# Altium schematic sheet 04-Power_3v3.SchDoc: Power
size A; Revision: A; SheetNumber: 4; SheetTotal: 6
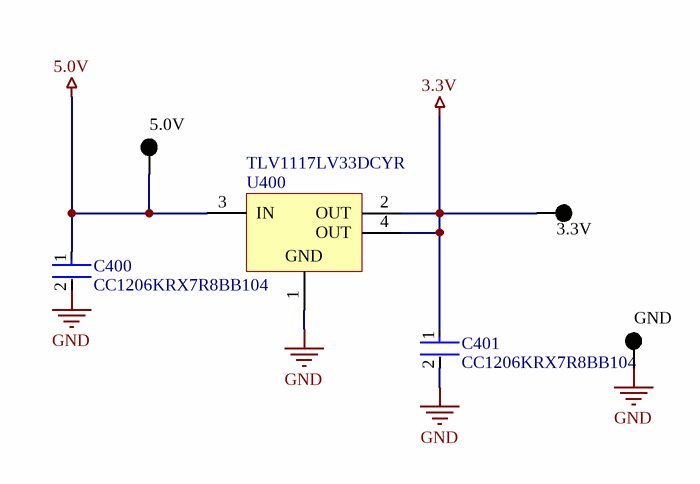
[diagram p0: 04-Power_3v3.SchDoc]

## Parts
3.3V  5011  [KSTN-5011_V]  (value not drawn)
5.0V  5011  [KSTN-5011_V]  (value not drawn)
C400  CC1206KRX7R8BB104  [FP-CC1206-1_25-MFG]
C401  CC1206KRX7R8BB104  [FP-CC1206-1_25-MFG]
GND  5011  [KSTN-5011_V]  (value not drawn)
U400  TLV1117LV33DCYR  [DCY0004A_N]

## Nets
3.3V: 3.3V.1 C401.1 U400.2(OUT) U400.4(OUT)
5.0V: 5.0V.1 C400.1 U400.3(IN)
GND: C400.2 C401.2 GND.1 U400.1(GND)

## Notes on the sheet
- Title:
- Size:
- A
- Project
- Rev:
- Sheet:
- of
- College of Engineering
- 1415 Engineering Drive
- Madison, WI 53706

## Library data of the parts
3.3V 5.0V GND = CMP-1672-00003-4: Test Point, Black, Through Hole, RoHS, Bulk; Manufacturer: Keystone; ComponentLink2URL: http://www.keyelco.com/product-pdf.cfm?p=1320; Colour: Black; Pins: 1; REACH SVHC: No SVHC; ComponentLink1URL: http://www.keyelco.com/; PackageReference: 5011; Contact Plating: Silver; Package Quantity: 100; Packaging: Bulk; RoHSCompliant: true; Height: 8.12 mm; PackageDescription: 1-Pin Through Hole Device, Dia 3.17 mm; Mount: Through Hole; Mounting Technology: Through Hole; DatasheetVersion: Rev. F, 12/2013; ComponentLink1Description: Manufacturer URL; Contact Material: Bronze; ComponentLink2Description: Datasheet
C400 C401 = CMP-1037-04191-3: CAP CER 0.1UF 25V X7R 1206; Manufacturer: Yageo; Value: 100 nF; Material: Ceramic; Tolerance: 0.1; Automotive Grade: NA; Temperature Coefficient: 15%; Description: CC1206 100 nF X7R 10.00%25 V; Category: Cap; Voltage Rating: 25 V; Temperature Range Low: -55°C; Lead Free: Yes; Mouser Description: Multilayer Ceramic Capacitors MLCC - SMD/SMT 100nF 25V X7R 10%; Manufacturer Part Number: CC1206KRX7R8BB104; Octopart: https://octopart.com/cc1206krx7r8bb104-yageo-42334534; Device Class L1: Passive Components; Capacitance: 100 nF; RoHS: TRUE; Automotive: No; Package: CC1206-1.25; Device Class L2: Capacitors; Footprint Url: http://www.yageo.com/exep/pages/download/literatures/UPY-C_GEN_24.pdf; Height: 1.45mm; Temperature: -55°C to +125°C; Temperature Range High: +125°C; ComponentLink2URL: http://www.yageo.com/documents/recent/UPY-NP0X7R_HV_1KV-to-3KV_11.pdf; Temperature Characteristic: X7R; Device Class L3: Ceramic Capacitors; Digikey Description: CAP CER 0.1UF 25V X7R 1206; ComponentLink2Description: Datasheet
U400 = CMP-0395-00503-2: Single Output LDO, 1 A, Fixed 3.3 V Output, 2 to 5.5 V Input, 4-pin SOT-223 (DCY), -40 to 125 degC, Green (RoHS & no Sb/Br); Manufacturer: Texas Instruments; Vout Adj(Min)(V): 3.3; Vdo(Typ)(mV): 1200; Iq(Typ)(mA): 0.05; Accuracy(%): 2; Iout(Max)(A): 1; SubFamily: Single Channel LDO; Vin(Max)(V): 5.5; PackageReference: DCY0004A; PackageDescription: 4-Pin Plastic Small Outline, Body 3.5 x 6.5 mm, Pitch 2.3 mm; Vout Adj(Max)(V): 3.3; Mounting Technology: Surface Mount; ComponentLink2Description: Datasheet; ComponentLink1Description: Manufacturer URL; PartNumber: TLV1117LV33DCYR; ComponentLink3Description: Package Specification; ComponentLink1URL: http://www.ti.com/; ComponentLink2URL: http://www.ti.com/general/docs/lit/getliterature.tsp?genericPartNumber=TLV1117LV33&fileType=pdf; Fixed Output Options(V): 3.3; PackageVersion: 4202506/B; Vin(Min)(V): 2; DatasheetVersion: SBVS160A; Eco-Plan: Green (RoHS & no Sb/Br); ComponentLink3URL: http://www.ti.com/litv/pdf/mpds094a; Code_JEDEC: TO-261